# EAGLE schematic dimmer (EAGLE 6.4)
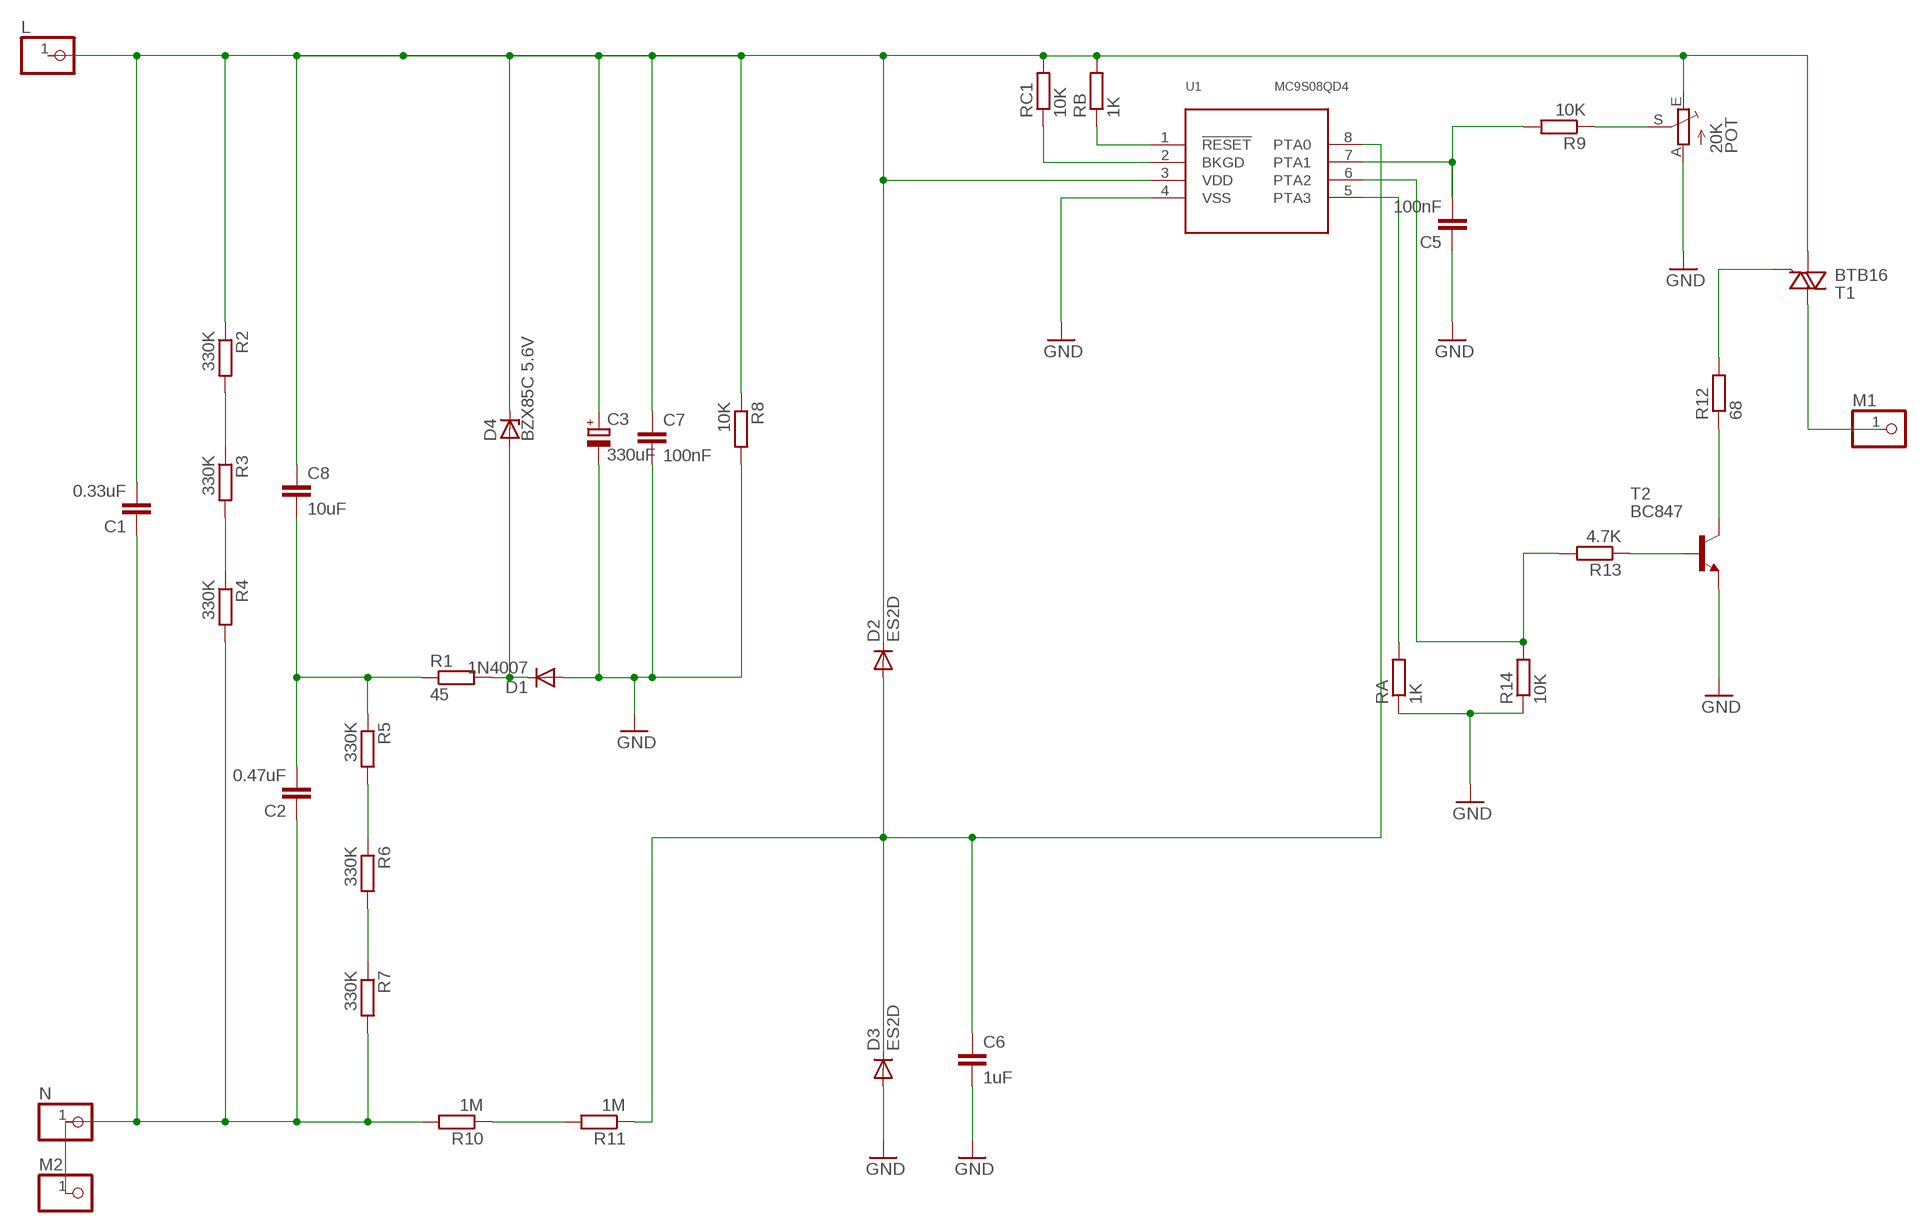
[diagram p0: schematic, sheet 1]

## Parts
C1  0.33uF  C-EU075-032X103  [C075-032X103]
C2  0.47uF  C-EU075-032X103  [C075-032X103]
C3  330uF  CPOL-EUE5-5  [E5-5]
C5  100nF  C-EUC1210  [C1210]
C6  1uF  C-EUC1210  [C1210]
C7  100nF  C-EUC1210  [C1210]
C8  10uF  C-EUC1210  [C1210]
D1  1N4007  1N4004  [DO41-10]
D2  ES2D  [SMB]
D3  ES2D  [SMB]
D4  BZX85C 5.6V  ZTK  [DO35Z10]
L  PINHD-1X1  [1X01]
M1  PINHD-1X1  [1X01]
M2  PINHD-1X1  [1X01]
N  PINHD-1X1  [1X01]
POT  20K  TRIM_EU-PT10  [PT-10]
R1  45  R-EU_0207/10  [0207/10]
R2  330K  R-EU_R1210  [R1210]
R3  330K  R-EU_R1210  [R1210]
R4  330K  R-EU_R1210  [R1210]
R5  330K  R-EU_R1210  [R1210]
R6  330K  R-EU_R1210  [R1210]
R7  330K  R-EU_R1210  [R1210]
R8  10K  R-EU_R1210  [R1210]
R9  10K  R-EU_R1210  [R1210]
R10  1M  R-EU_R1210  [R1210]
R11  1M  R-EU_R1210  [R1210]
R12  68  R-EU_R1210  [R1210]
R13  4.7K  R-EU_R1210  [R1210]
R14  10K  R-EU_R1210  [R1210]
RA  1K  R-EU_R1210  [R1210]
RB  1K  R-EU_R1210  [R1210]
RC1  10K  R-EU_R1210  [R1210]
T1  BTB16  TIC253  [TO218DS]
T2  BC847  BC847ASMD  [SOT23]
U1  MC9S08QD4  [MC9S08QD4]

## Nets
GND: C3.- C5.1 C6.2 C7.2 D1.A D3.A POT.A R8.2 R14.1 RA.1 T2.2(E) U1.4(VSS)
N$0: C2.2 C8.2 R1.1 R5.1
N$1: D1.C D4.A R1.2
N$2: C1.2 C3.+ C7.1 C8.1 D2.C D4.C L.1 POT.E R2.1 R8.1 RB.2 RC1.2 T1.A1 U1.3(VDD)
N$3: R2.2 R3.1
N$4: R3.2 R4.1
N$5: C1.1 C2.1 M2.1 N.1 R4.2 R7.2 R10.2
N$6: R5.2 R6.1
N$7: R6.2 R7.1
N$9: POT.S R9.1
N$10: C5.2 R9.2 U1.7(PTA1)
N$11: R10.1 R11.2
N$12: C6.1 D2.A D3.C R11.1 U1.8(PTA0)
N$13: R12.1 T2.3(C)
N$14: R12.2 T1.G
N$15: R13.1 T2.1(B)
N$16: R13.2 R14.2 U1.6(PTA2)
N$17: RA.2 U1.5(PTA3)
N$18: RC1.1 U1.2(BKGD)
N$19: RB.1 U1.1(!RESET)
N$20: M1.1 T1.A2

## Library data of the parts
C1 C2 C5-C8 = rcl:C-EU: CAPACITOR, European symbol
C3 = rcl:CPOL-EU: POLARIZED CAPACITOR, European symbol
D1 = diode:1N4004: DIODE general purpose rectifier, 1 A
D2 D3 = diode:ES2D: DIODE super fast rectifier, 2 A
D4 = diode:ZTK: Z DIODE
L M1 M2 N = pinhead:PINHD-1X1: PIN HEADER
POT = pot:TRIM_EU-: POTENTIOMETER
R1-R14 RA RB RC1 = rcl:R-EU_: RESISTOR, European symbol
T1 = triac:TIC253: TRIAC
T2 = transistor-npn:BC847*: NPN Transistor
U1 = MC9S08QD4:MC9S08QD4